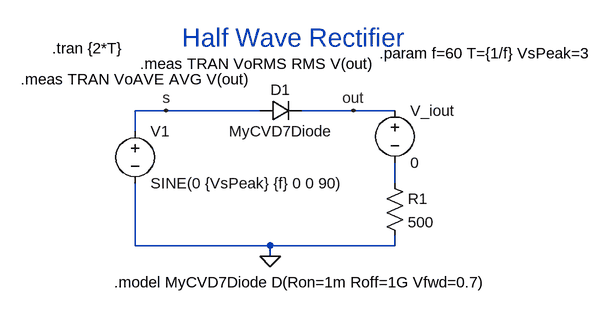
[diagram p0: schematic half_wave_rectifier.asc]
half_wave_rectifier.asc, the LTspice schematic file:
Version 4.1
SHEET 1 880 680
WIRE 48 96 0 96
WIRE 192 96 48 96
WIRE 336 96 256 96
WIRE 400 96 336 96
WIRE 0 128 0 96
WIRE 400 208 400 176
WIRE 0 304 0 208
WIRE 208 304 0 304
WIRE 400 304 400 288
WIRE 400 304 208 304
WIRE 208 320 208 304
FLAG 208 320 0
FLAG 336 96 out
FLAG 48 96 s
SYMBOL voltage 0 112 R0
WINDOW 123 0 0 Left 0
WINDOW 39 0 0 Left 0
SYMATTR InstName V1
SYMATTR Value SINE(0 {VsPeak} {f} 0 0 90)
SYMBOL diode 192 112 R270
WINDOW 0 32 32 VTop 2
WINDOW 3 0 32 VBottom 2
SYMATTR InstName D1
SYMATTR Value MyCVD7Diode
SYMBOL voltage 400 80 R0
WINDOW 123 0 0 Left 0
WINDOW 39 0 0 Left 0
SYMATTR InstName V_iout
SYMATTR Value 0
SYMBOL res 384 192 R0
SYMATTR InstName R1
SYMATTR Value 500
TEXT 72 -16 Left 4 ;Half Wave Rectifier
TEXT -32 360 Left 2 !.model MyCVD7Diode D(Ron=1m Roff=1G Vfwd=0.7)
TEXT -128 0 Left 2 !.tran {2*T}
TEXT -176 48 Left 2 !.meas TRAN VoAVE AVG V(out)
TEXT 8 24 Left 2 !.meas TRAN VoRMS RMS V(out)
TEXT 376 8 Left 2 !.param f=60 T={1/f} VsPeak=3

The netlist it stands for:
* half_wave_rectifier.asc
V1 s 0 SINE(0 {VsPeak} {f} 0 0 90)
D1 s out MyCVD7Diode
V_iout out N001 0
R1 N001 0 500
.model D D
.lib standard.dio
* Half Wave Rectifier
.model MyCVD7Diode D(Ron=1m Roff=1G Vfwd=0.7)
.tran {2*T}
.meas TRAN VoAVE AVG V(out)
.meas TRAN VoRMS RMS V(out)
.param f=60 T={1/f} VsPeak=3
.backanno
.end